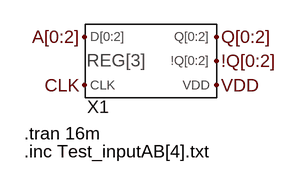
[diagram p0: schematic Test_REG[3].asc]
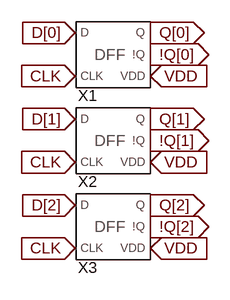
[diagram p1: sub-circuit reg[3].asc]
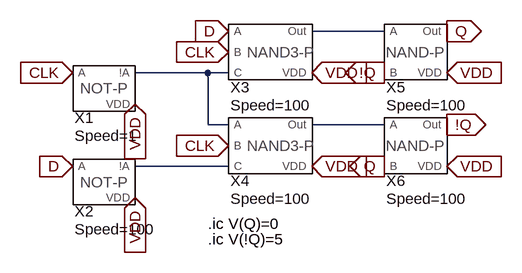
[diagram p2: sub-circuit dff.asc]
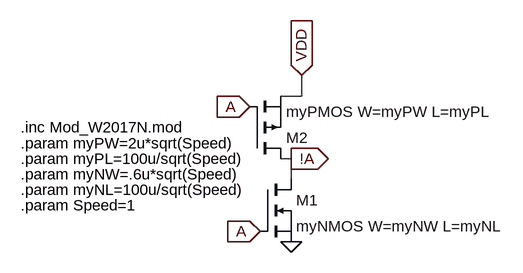
[diagram p3: sub-circuit gate_not_param.asc]
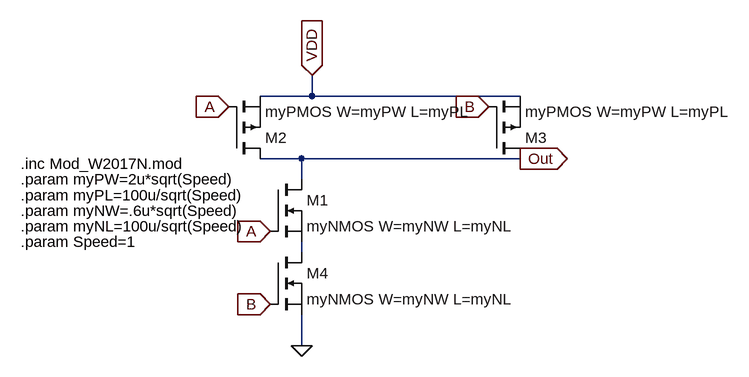
[diagram p4: sub-circuit gate_nand_param.asc]
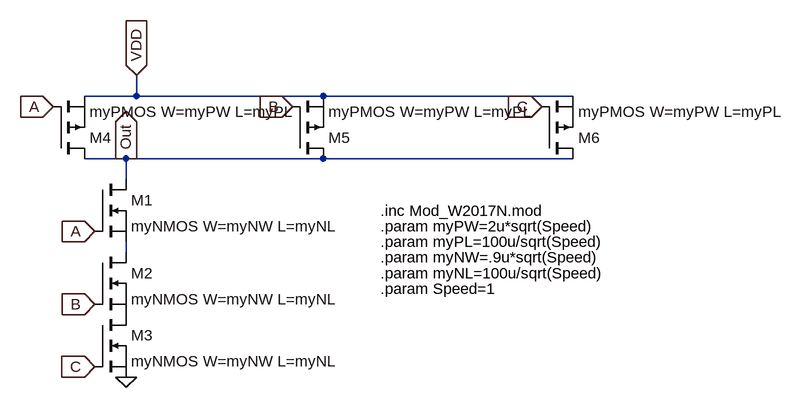
[diagram p5: sub-circuit gate_nand3_param.asc]
Test_REG[3].asc, the LTspice schematic file:
Version 4
SHEET 1 880 680
FLAG 48 176 CLK
FLAG 48 112 A[0:2]
FLAG 224 176 VDD
FLAG 224 112 Q[0:2]
FLAG 224 144 !Q[0:2]
SYMBOL REG[3] 96 144 R0
SYMATTR InstName X1
TEXT -32 240 Left 2 !.tran 16m
TEXT -32 264 Left 2 !.inc Test_inputAB[4].txt

reg[3].asc, the sub-circuit schematic file:
Version 4
SHEET 1 880 680
FLAG 368 112 VDD
IOPIN 368 112 In
FLAG 368 -16 VDD
IOPIN 368 -16 In
FLAG 368 240 VDD
IOPIN 368 240 In
FLAG 368 -80 Q[0]
IOPIN 368 -80 Out
FLAG 368 -48 !Q[0]
IOPIN 368 -48 Out
FLAG 368 48 Q[1]
IOPIN 368 48 Out
FLAG 368 80 !Q[1]
IOPIN 368 80 Out
FLAG 368 176 Q[2]
IOPIN 368 176 Out
FLAG 368 208 !Q[2]
IOPIN 368 208 Out
FLAG 256 176 D[2]
IOPIN 256 176 In
FLAG 256 240 CLK
IOPIN 256 240 In
FLAG 256 48 D[1]
IOPIN 256 48 In
FLAG 256 -80 D[0]
IOPIN 256 -80 In
FLAG 256 112 CLK
IOPIN 256 112 In
FLAG 256 -16 CLK
IOPIN 256 -16 In
SYMBOL DFF 304 80 R0
SYMATTR InstName X2
SYMBOL DFF 304 -48 R0
SYMATTR InstName X1
SYMBOL DFF 304 208 R0
SYMATTR InstName X3

dff.asc, the sub-circuit schematic file:
Version 4
SHEET 1 880 680
WIRE 272 -64 160 -64
WIRE 0 0 -112 0
WIRE 32 0 0 0
WIRE 0 80 0 0
WIRE 32 80 0 80
WIRE 272 80 160 80
WIRE 32 144 -112 144
FLAG -208 144 D
IOPIN -208 144 In
FLAG -208 0 CLK
IOPIN -208 0 In
FLAG -112 48 VDD
IOPIN -112 48 In
FLAG 32 -64 D
IOPIN 32 -64 In
FLAG 32 112 CLK
IOPIN 32 112 In
FLAG 32 -32 CLK
IOPIN 32 -32 In
FLAG 160 144 VDD
IOPIN 160 144 In
FLAG 160 0 VDD
IOPIN 160 0 In
FLAG 368 0 VDD
IOPIN 368 0 In
FLAG 368 144 VDD
IOPIN 368 144 In
FLAG 368 -64 Q
IOPIN 368 -64 Out
FLAG 368 80 !Q
IOPIN 368 80 Out
FLAG 272 0 !Q
IOPIN 272 0 Out
FLAG 272 144 Q
IOPIN 272 144 Out
FLAG -112 192 VDD
IOPIN -112 192 In
SYMBOL Gate_NOT_PARAM -160 32 R0
WINDOW 39 -45 65 Left 2
SYMATTR SpiceLine Speed=1
SYMATTR InstName X1
SYMBOL Gate_NOT_PARAM -160 176 R0
WINDOW 39 -45 65 Left 2
SYMATTR SpiceLine Speed=100
SYMATTR InstName X2
SYMBOL Gate_NAND_PARAM 320 112 R0
WINDOW 39 -45 82 Left 2
SYMATTR SpiceLine Speed=100
SYMATTR InstName X6
SYMBOL Gate_NAND_PARAM 320 -32 R0
WINDOW 39 -45 82 Left 2
SYMATTR SpiceLine Speed=100
SYMATTR InstName X5
SYMBOL Gate_NAND3_PARAM 96 -32 R0
WINDOW 39 -61 82 Left 2
SYMATTR SpiceLine Speed=100
SYMATTR InstName X3
SYMBOL Gate_NAND3_PARAM 96 112 R0
WINDOW 39 -61 82 Left 2
SYMATTR SpiceLine Speed=100
SYMATTR InstName X4
TEXT 0 232 Left 2 !.ic V(Q)=0
TEXT 0 256 Left 2 !.ic V(!Q)=5

gate_not_param.asc, the sub-circuit schematic file:
Version 4
SHEET 1 880 680
WIRE 64 -112 64 -144
WIRE 64 -112 32 -112
WIRE 48 -16 32 -16
WIRE 48 16 48 -16
FLAG 48 -16 !A
IOPIN 48 -16 Out
FLAG 64 -144 VDD
IOPIN 64 -144 In
FLAG 48 112 0
FLAG 0 96 A
IOPIN 0 96 In
FLAG -16 -96 A
IOPIN -16 -96 In
SYMBOL nmos 0 16 R0
SYMATTR InstName M1
SYMATTR Value myNMOS W=myNW L=myNL
SYMBOL pmos -16 -16 M180
SYMATTR InstName M2
SYMATTR Value myPMOS W=myPW L=myPL
TEXT -368 -64 Left 2 !.inc Mod_W2017N.mod
TEXT -368 -40 Left 2 !.param myPW=2u*sqrt(Speed)
TEXT -368 -16 Left 2 !.param myPL=100u/sqrt(Speed)
TEXT -368 8 Left 2 !.param myNW=.6u*sqrt(Speed)
TEXT -368 32 Left 2 !.param myNL=100u/sqrt(Speed)
TEXT -368 56 Left 2 !.param Speed=1

gate_nand_param.asc, the sub-circuit schematic file:
Version 4
SHEET 1 880 680
WIRE 64 -112 64 -144
WIRE 64 -112 -16 -112
WIRE 384 -112 64 -112
WIRE 48 -16 -16 -16
WIRE 384 -16 48 -16
WIRE 48 16 48 -16
WIRE 48 128 48 112
WIRE 48 272 48 224
FLAG 48 272 0
FLAG 64 -144 VDD
IOPIN 64 -144 In
FLAG 0 208 B
IOPIN 0 208 In
FLAG 0 96 A
IOPIN 0 96 In
FLAG -64 -96 A
IOPIN -64 -96 In
FLAG 336 -96 B
IOPIN 336 -96 In
FLAG 384 -16 Out
IOPIN 384 -16 Out
SYMBOL nmos 0 16 R0
SYMATTR InstName M1
SYMATTR Value myNMOS W=myNW L=myNL
SYMBOL pmos -64 -16 M180
SYMATTR InstName M2
SYMATTR Value myPMOS W=myPW L=myPL
SYMBOL pmos 336 -16 M180
SYMATTR InstName M3
SYMATTR Value myPMOS W=myPW L=myPL
SYMBOL nmos 0 128 R0
SYMATTR InstName M4
SYMATTR Value myNMOS W=myNW L=myNL
TEXT -384 -8 Left 2 !.inc Mod_W2017N.mod
TEXT -384 16 Left 2 !.param myPW=2u*sqrt(Speed)
TEXT -384 40 Left 2 !.param myPL=100u/sqrt(Speed)
TEXT -384 64 Left 2 !.param myNW=.6u*sqrt(Speed)
TEXT -384 88 Left 2 !.param myNL=100u/sqrt(Speed)
TEXT -384 112 Left 2 !.param Speed=1

gate_nand3_param.asc, the sub-circuit schematic file:
Version 4
SHEET 1 1256 680
WIRE 64 -112 64 -144
WIRE 64 -112 -16 -112
WIRE 352 -112 64 -112
WIRE 736 -112 352 -112
WIRE 48 -16 -16 -16
WIRE 352 -16 48 -16
WIRE 736 -16 352 -16
WIRE 48 16 48 -16
WIRE 48 128 48 112
FLAG 48 320 0
FLAG 0 208 B
IOPIN 0 208 In
FLAG 48 -16 Out
IOPIN 48 -16 Out
FLAG 64 -144 VDD
IOPIN 64 -144 In
FLAG 304 -96 B
IOPIN 304 -96 In
FLAG -64 -96 A
IOPIN -64 -96 In
FLAG 0 96 A
IOPIN 0 96 In
FLAG 0 304 C
IOPIN 0 304 In
FLAG 688 -96 C
IOPIN 688 -96 In
SYMBOL nmos 0 16 R0
SYMATTR InstName M1
SYMATTR Value myNMOS W=myNW L=myNL
SYMBOL pmos -64 -16 M180
SYMATTR InstName M4
SYMATTR Value myPMOS W=myPW L=myPL
SYMBOL pmos 304 -16 M180
SYMATTR InstName M5
SYMATTR Value myPMOS W=myPW L=myPL
SYMBOL nmos 0 128 R0
SYMATTR InstName M2
SYMATTR Value myNMOS W=myNW L=myNL
SYMBOL nmos 0 224 R0
SYMATTR InstName M3
SYMATTR Value myNMOS W=myNW L=myNL
SYMBOL pmos 688 -16 M180
SYMATTR InstName M6
SYMATTR Value myPMOS W=myPW L=myPL
TEXT 440 64 Left 2 !.inc Mod_W2017N.mod
TEXT 440 88 Left 2 !.param myPW=2u*sqrt(Speed)
TEXT 440 112 Left 2 !.param myPL=100u/sqrt(Speed)
TEXT 440 136 Left 2 !.param myNW=.9u*sqrt(Speed)
TEXT 440 160 Left 2 !.param myNL=100u/sqrt(Speed)
TEXT 440 184 Left 2 !.param Speed=1

The netlist it stands for:
* Test_REG[3].asc
XX1 A[0] A[1] A[2] VDD Q[0] Q[1] Q[2] CLK !Q[0] !Q[1] !Q[2] reg[3]

* block symbol definitions
.subckt reg[3] D[0] D[1] D[2] VDD Q[0] Q[1] Q[2] CLK !Q[0] !Q[1] !Q[2]
XX2 D[1] VDD Q[1] CLK !Q[1] dff
XX1 D[0] VDD Q[0] CLK !Q[0] dff
XX3 D[2] VDD Q[2] CLK !Q[2] dff
.ends reg[3]

.subckt dff D VDD Q CLK !Q
XX1 CLK VDD N002 gate_not_param params: Speed=1
XX2 D VDD N004 gate_not_param params: Speed=100
XX6 N003 Q !Q VDD gate_nand_param params: Speed=100
XX5 N001 !Q Q VDD gate_nand_param params: Speed=100
XX3 D CLK N002 VDD N001 gate_nand3_param params: Speed=100
XX4 N002 CLK N004 VDD N003 gate_nand3_param params: Speed=100
.ic V(Q)=0
.ic V(!Q)=5
.ends dff

.subckt gate_not_param A VDD !A
M1 !A A 0 0 myNMOS W=myNW L=myNL
M2 !A A VDD VDD myPMOS W=myPW L=myPL
.inc Mod_W2017N.mod
.param myPW=2u*sqrt(Speed)
.param myPL=100u/sqrt(Speed)
.param myNW=.6u*sqrt(Speed)
.param myNL=100u/sqrt(Speed)
.param Speed=1
.ends gate_not_param

.subckt gate_nand_param A B Out VDD
M1 Out A N001 N001 myNMOS W=myNW L=myNL
M2 Out A VDD VDD myPMOS W=myPW L=myPL
M3 Out B VDD VDD myPMOS W=myPW L=myPL
M4 N001 B 0 0 myNMOS W=myNW L=myNL
.inc Mod_W2017N.mod
.param myPW=2u*sqrt(Speed)
.param myPL=100u/sqrt(Speed)
.param myNW=.6u*sqrt(Speed)
.param myNL=100u/sqrt(Speed)
.param Speed=1
.ends gate_nand_param

.subckt gate_nand3_param A B C VDD Out
M1 Out A N001 N001 myNMOS W=myNW L=myNL
M4 Out A VDD VDD myPMOS W=myPW L=myPL
M5 Out B VDD VDD myPMOS W=myPW L=myPL
M2 N001 B P001 P001 myNMOS W=myNW L=myNL
M3 P001 C 0 0 myNMOS W=myNW L=myNL
M6 Out C VDD VDD myPMOS W=myPW L=myPL
.inc Mod_W2017N.mod
.param myPW=2u*sqrt(Speed)
.param myPL=100u/sqrt(Speed)
.param myNW=.9u*sqrt(Speed)
.param myNL=100u/sqrt(Speed)
.param Speed=1
.ends gate_nand3_param

.model NMOS NMOS
.model PMOS PMOS
.lib standard.mos
.tran 16m
.inc Test_inputAB[4].txt
.backanno
.end